# EAGLE design glass_udrive_pcb (EAGLE 7.7.0)
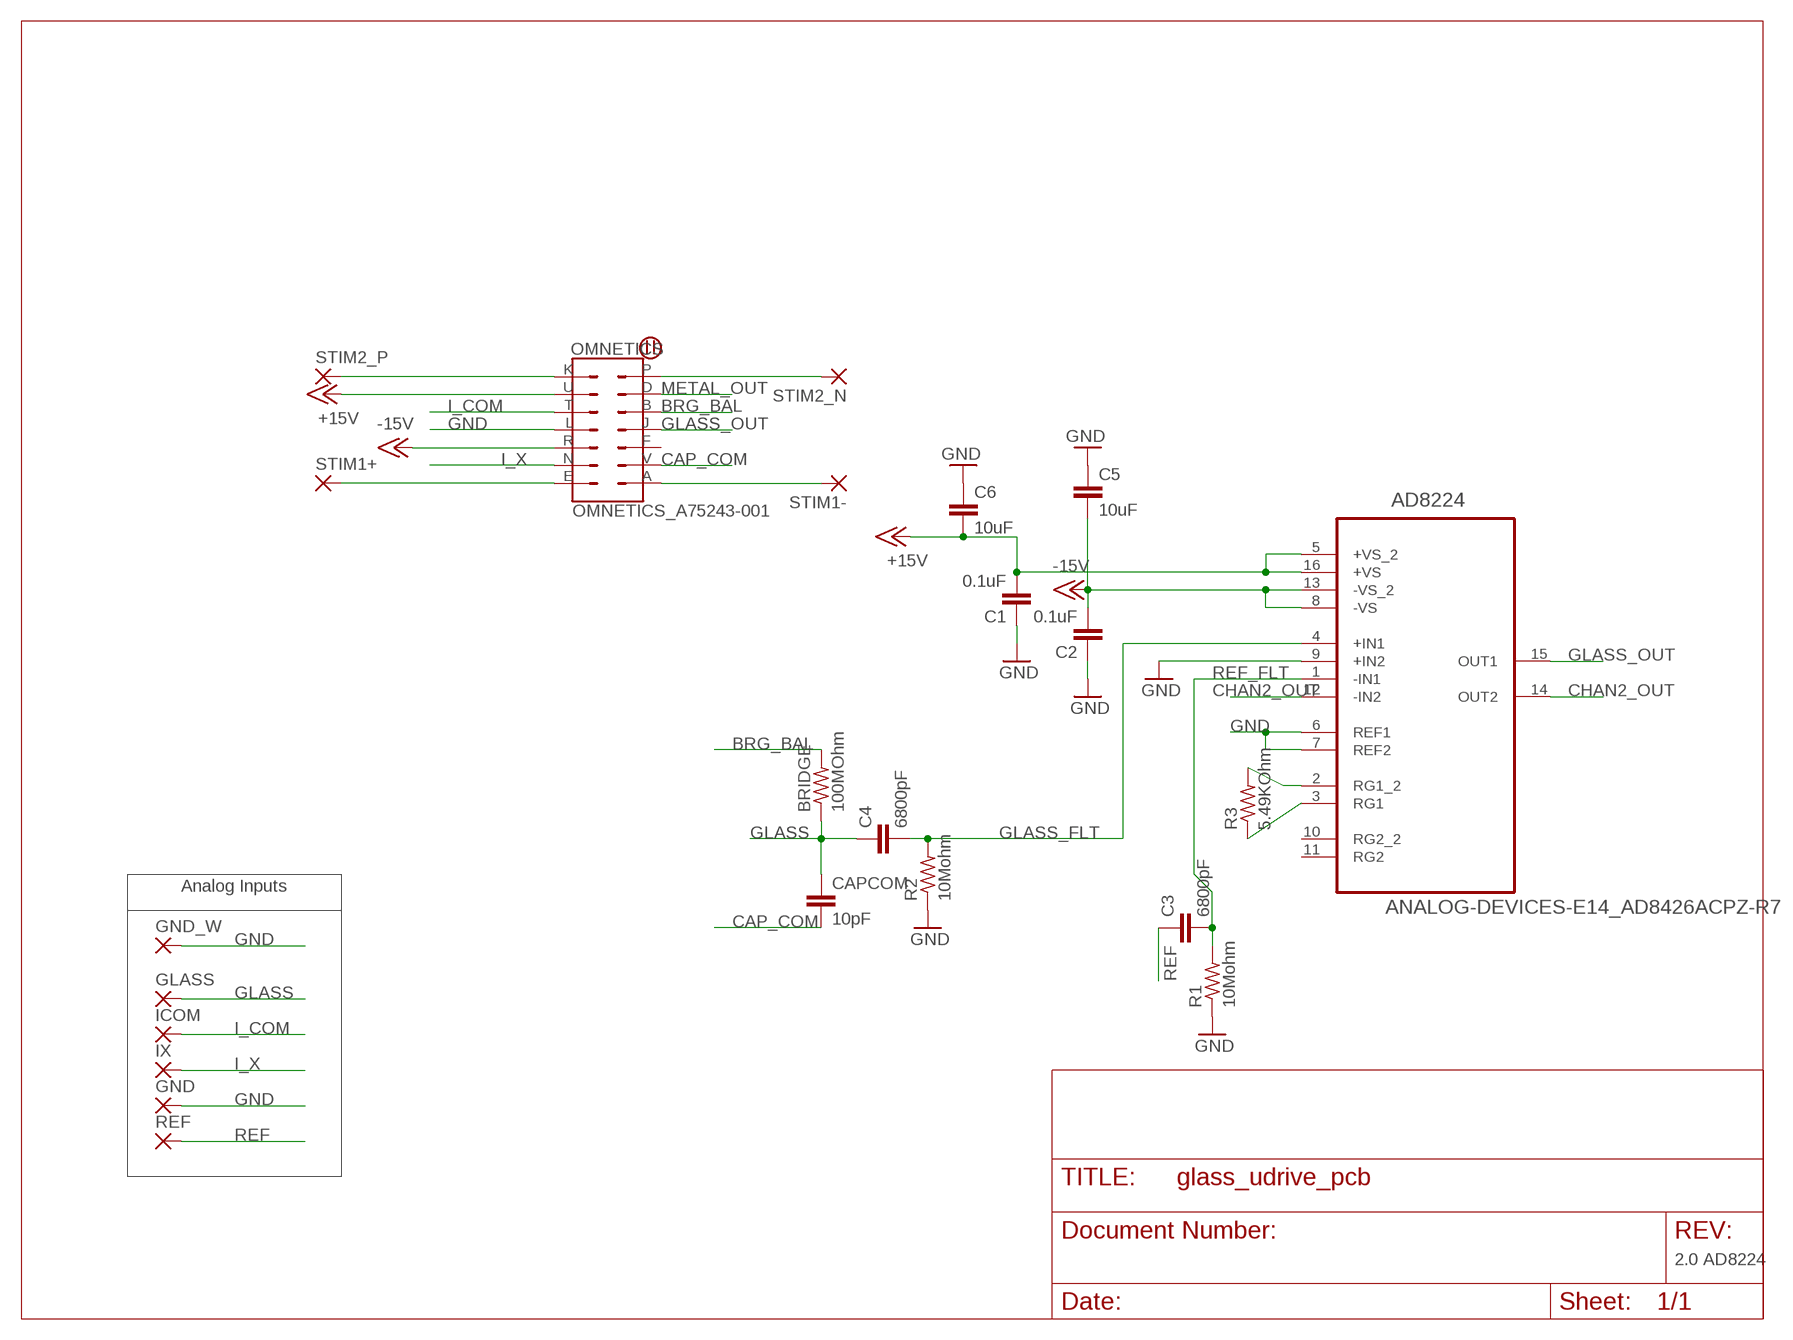
[diagram p0: schematic, sheet 1]

## Parts
AD8224  ANALOG-DEVICES-E14_AD8426ACPZ-R7  [ANALOG-DEVICES-E14_QFN65P400X400X100-16N]
BRIDGE  100MOhm  R_1206  [1206]
C1  0.1uF  C_0201  [0201]
C2  0.1uF  C_0201  [0201]
C3  6800pF  C_0201  [0201]
C4  6800pF  C_0201  [0201]
C5  10uF  C_0603  [0603]
C6  10uF  C_0603  [0603]
CAPCOM  10pF  C_0402  [0402]
GLASS  THROUGH-HOLE-30MIL/15MIL  [30MIL/15MIL]
GND  THROUGH-HOLE-30MIL/15MIL  [30MIL/15MIL]
GND_W  THROUGH-HOLE-30MIL/15MIL  [30MIL/15MIL]
ICOM  THROUGH-HOLE-30MIL/15MIL  [30MIL/15MIL]
IX  THROUGH-HOLE-30MIL/15MIL  [30MIL/15MIL]
OMNETICS  OMNETICS_A75243-001  [OMNETICS_A75243-001]
R1  10Mohm  R_0201  [0201]
R2  10Mohm  R_0201  [0201]
R3  5.49KOhm  R_0201  [0201]
REF  THROUGH-HOLE-30MIL/15MIL  [30MIL/15MIL]
STIM1+  THROUGH-HOLE-30MIL/15MIL  [30MIL/15MIL]
STIM1-  THROUGH-HOLE-30MIL/15MIL  [30MIL/15MIL]
STIM2_N  THROUGH-HOLE-30MIL/15MIL  [30MIL/15MIL]
STIM2_P  THROUGH-HOLE-30MIL/15MIL  [30MIL/15MIL]

## Nets
+15V: AD8224.5(+VS_2) AD8224.16(+VS) C1.2 C6.2 OMNETICS.U
-15V: AD8224.8(-VS) AD8224.13(-VS_2) C2.2 C5.2 OMNETICS.R
BRG_BAL: BRIDGE.2 OMNETICS.B
CAP_COM: CAPCOM.2 OMNETICS.V
CHAN2_OUT: AD8224.12(-IN2) AD8224.14(OUT2)
GLASS: BRIDGE.1 C4.1 CAPCOM.1 GLASS.P$1(P)
GLASS_FLT: AD8224.4(+IN1) C4.2 R2.2
GLASS_OUT: AD8224.15(OUT1) OMNETICS.J
GND: AD8224.6(REF1) AD8224.7(REF2) AD8224.9(+IN2) C1.1 C2.1 C5.1 C6.1 GND.P$1(P) GND_W.P$1(P) OMNETICS.L R1.1 R2.1
I_COM: ICOM.P$1(P) OMNETICS.T
I_X: IX.P$1(P) OMNETICS.N
METAL_OUT: OMNETICS.D
N$2: AD8224.2(RG1_2) R3.2
N$4: AD8224.3(RG1) R3.1
REF: C3.1 REF.P$1(P)
REF_FLT: AD8224.1(-IN1) C3.2 R1.2
STIM1_N: OMNETICS.A STIM1-.P$1(P)
STIM1_P: OMNETICS.E STIM1+.P$1(P)
STIM2_N: OMNETICS.P STIM2_N.P$1(P)
STIM2_P: OMNETICS.K STIM2_P.P$1(P)
Unconnected: AD8224.10(RG2_2) AD8224.11(RG2) OMNETICS.F

## Notes on the sheet
- Analog Inputs
- 2.0 AD8224

## Library data of the parts
AD8224 = GyroDrive:ANALOG-DEVICES-E14_AD8426ACPZ-R7: Wide Supply Range, Rail-to-Rail Output Instrumentation Amplifier; MPN: AD8426ACPZ-R7; OC_FARNELL: 1971714; OC_NEWARK: 58T4523; PACKAGE: LFCSP-16; SUPPLIER: Analog Devices
BRIDGE R1-R3 = GFL:R: Resistor
C1-C6 CAPCOM = GFL:C: Capacitor
GLASS GND GND_W ICOM IX REF STIM1+ STIM1- STIM2_N STIM2_P = GFL:THROUGH-HOLE-30MIL/15MIL: THROUGH-HOLE PAD
OMNETICS = GFL:OMNETICS_A75243-001

## Board
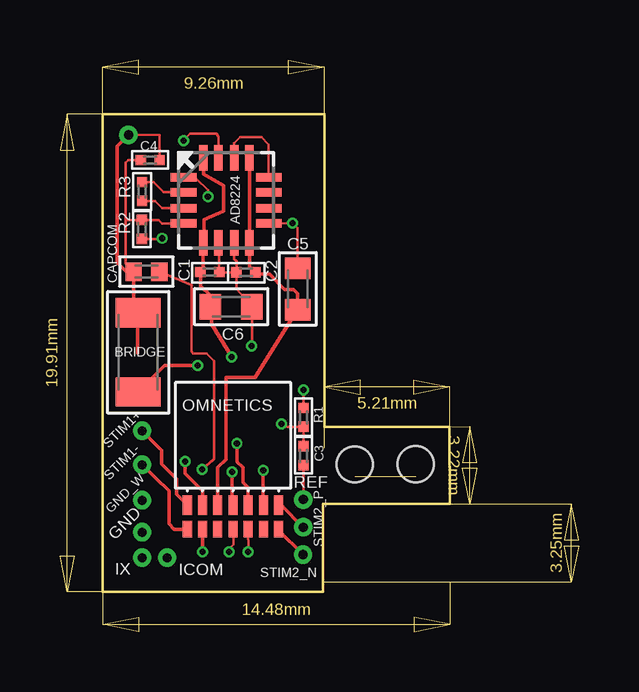
[diagram p1: board, top side]
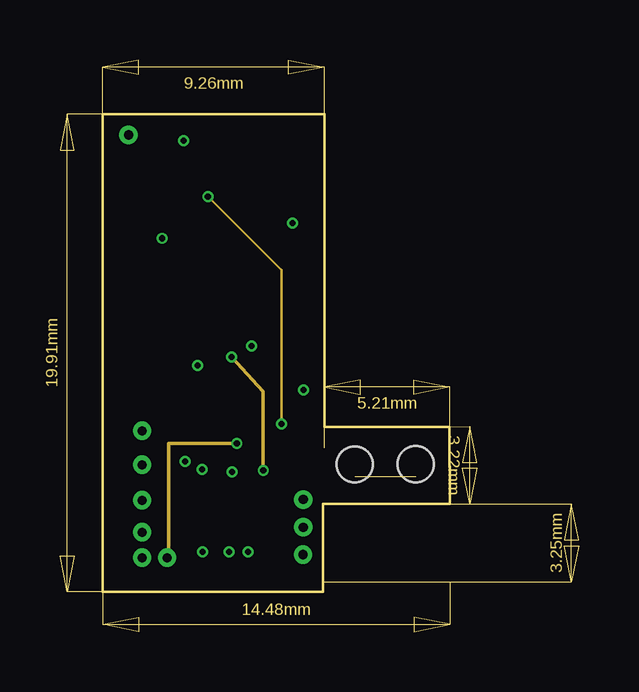
[diagram p2: board, inner layer Route2]
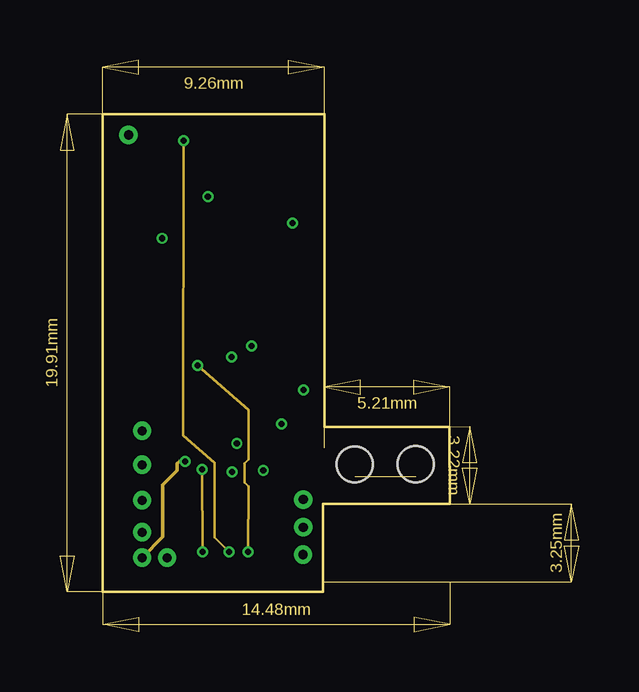
[diagram p3: board, inner layer Route15]
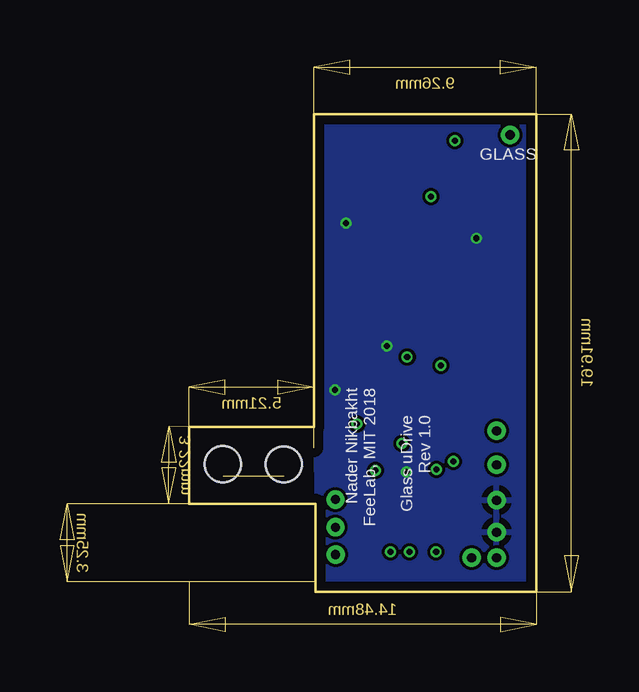
[diagram p4: board, bottom side, seen from below]

Size 14.48 x 19.91 mm. Coordinates in mm from the lower left corner, seen from the top.
Outline: 9.26,6.87 9.26,19.91 0,19.91 0,0 9.2,0 9.2,3.66 14.48,3.66 14.47,6.88 9.26,6.88
Copper layers (1*2*15*16): Top 0.035559375mm / dielectric 0.17018125mm / Route2 0.01778125mm / dielectric 47mil / Route15 0.01778125mm / dielectric 0.17018125mm / Bottom 0.035559375mm
Design rules "pcbway *": minimum track width 4mil, minimum drill 10mil, track to track 5mil, track to pad 5mil, pad to pad 5mil, via to via 5mil, smd to smd 5mil, copper to edge 15mil, drill to drill 6mil, minimum pad ring 4mil, minimum via ring 4mil, stop-mask expansion 2.5mil, vias tented up to drill 12mil, thermal gap 10mil
Holes 1.5 mm at 10.52,5.3 13.06,5.31

### Footprints (pad centres in the part's own frame; a part is rotated, then mirrored left to right if it is on the bottom)
ANALOG-DEVICES-E14_QFN65P400X400X100-16N = smd 1.067 x 0.356: 1 -1.778,0.965; 2 -1.778,0.33; 3 -1.778,-0.33; 4 -1.778,-0.965; 9 1.778,-0.965; 10 1.778,-0.33; 11 1.778,0.33; 12 1.778,0.965 | smd 0.356 x 1.067: 5 -0.965,-1.778; 6 -0.33,-1.778; 7 0.33,-1.778; 8 0.965,-1.778; 13 0.965,1.778; 14 0.33,1.778; 15 -0.33,1.778; 16 -0.965,1.778
1206 = smd 1.219 x 1.88: 1 -1.651,0; 2 1.651,0
0201 = smd 0.432 x 0.432: 1 -0.394,0; 2 0.394,0
0603 = smd 0.889 x 1.067: 1 -0.864,0; 2 0.864,0
0402 = smd 0.686 x 0.762: 1 -0.533,0; 2 0.533,0
30MIL/15MIL = drill 0.381 pad 0.762: P$1 0,0
OMNETICS_A75243-001 = smd 0.381 x 0.686: A -1.905,-0.47; B 0.635,-0.47; D 1.27,-0.47; F -0.635,-0.47; J 0,-0.47; P 1.905,-0.47; V -1.27,-0.47 | smd 0.381 x 0.813: E -1.905,0.533; K 1.905,0.533; L 0,0.533; N -1.27,0.533; R -0.635,0.533; T 0.635,0.533; U 1.27,0.533

### Placement (x,y rotation side)
AD8224  5.16,16.31 0 top
BRIDGE  1.49,9.98 270 top
C1  4.47,13.32 180 top
C2  5.98,13.31 0 top
C3  8.38,5.66 90 top
C4  1.99,17.99 180 top
C5  8.14,12.62 270 top
C6  5.37,11.88 180 top
CAPCOM  1.83,13.34 0 top
GLASS  1.08,19.04 0 top
GND  1.65,2.48 0 top
GND_W  1.65,3.81 0 top
ICOM  2.69,1.42 0 top
IX  1.65,1.42 0 top
OMNETICS  5.44,3.08 0 top
R1  8.38,7.26 270 top
R2  1.64,15.1 90 top
R3  1.65,16.68 90 top
REF  8.37,3.84 0 top
STIM1+  1.65,6.71 0 top
STIM1-  1.65,5.29 0 top
STIM2_N  8.36,1.55 0 top
STIM2_P  8.37,2.69 0 top

### Tracks (layer width: path | path; a pad name or v marks a point on that pad's centre or on a via)
+15V  (via drill 0.25)
  Top 0.127: 4.22,18.07 AD8224.16
  Top 0.152: 4.26,14.6 AD8224.5 | AD8224.5 4.2,13.5 C1.2 | OMNETICS.U v6.71,5.05 | C1.2 | 4.22,18.07 4.22,17.42 5.05,16.94 5.05,15.87 4.24,15.51 4.24,14.58 AD8224.5 | 4.52,11.97 C6.2 | C6.2 4.5,12.34 4.09,12.75 4.09,13.31 C1.2 | v5.38,9.79 5.38,9.81 4.55,11.15 4.55,11.94 C6.2
  Route2 0.152: v6.71,5.05 6.71,8.36 v5.38,9.79
-15V
  Top 0.152: OMNETICS.R 4.81,5.17 5.15,5.52 5.15,8.94 6.36,8.94 C5.2 8.14,12.43 7.98,12.6 7.6,12.6 6.96,13.23 6.46,13.23 C2.2 6.13,13.56 AD8224.8 AD8224.13
BRG_BAL  (via drill 0.25)
  Top 0.102: v6.07,1.66 6.09,1.69 OMNETICS.B
  Top 0.152: v3.97,9.42 2.59,9.42 BRIDGE.2
  Route15 0.102: v3.97,9.42 6.08,7.57 6.08,5.51 5.93,5.36 5.93,4.55 6.08,4.4 v6.07,1.66
CAP_COM  (via drill 0.25)
  Top 0.102: v4.15,5.1 v4.15,5.11 4.63,5.51 4.65,5.53 4.65,9.63 4.34,9.93 3.79,9.93 3.71,10.01 3.71,12.79 CAPCOM.2
  Top 0.152: v4.17,1.66 OMNETICS.V
  Route15 0.102: v4.15,5.1 v4.17,1.66
CHAN2_OUT
  Top 0.102: AD8224.14 5.49,18.69 5.74,18.94 6.63,18.94 6.93,18.64 AD8224.12
  Top 0.152: AD8224.12
GLASS
  Top 0.102: GLASS.P$1 2.38,19.04 C4.1
  Top 0.152: 1.47,9.96 1.47,11.63 BRIDGE.1 1.3,11.63 CAPCOM.1 0.98,13.34 0.61,13.72 0.61,18.57 GLASS.P$1
GLASS_FLT
  Top 0.102: C4.2 1.08,17.99 0.97,17.88 0.97,15.44 | 0.97,15.44 0.97,13.68 | 0.97,15.44 1.02,15.5 R2.2 2.33,15.5 2.49,15.34 AD8224.4
GLASS_OUT  (via drill 0.25)
  Top 0.102: AD8224.15 4.83,18.94 4.76,19.09 3.66,19.09 v3.39,18.8 3.36,18.61 | v5.28,1.66 5.28,1.79 5.46,1.97 5.46,2.59
  Top 0.152: 5.46,2.59 OMNETICS.J
  Route15 0.102: v3.39,18.8 3.36,6.51 4.68,5.37 4.67,4.42 4.67,2.27 v5.28,1.66
GND  (via drill 0.25)
  Top 0.102: AD8224.7 5.49,13.87 5.58,13.78 C2.1 | AD8224.6 4.87,14.5 C1.1 4.88,13.31 C2.1 | R1.1 v8.38,8.41 | AD8224.9 7.35,15.35 v7.93,15.37 8.14,15.16 C5.1 | 5.58,13.32 C2.1 | C6.1 v6.23,10.24 v6.22,10.24 | C6.1 6.23,12.08 | C2.1 | C2.1 5.59,12.63 C6.1 | R2.1 2.47,14.71 v2.49,14.73
  Top 0.152: OMNETICS.L 5.41,3.64 v5.41,5 | AD8224.7
  Bottom 0.102: v8.38,8.41 8.41,8.43 | v7.93,15.37 7.95,15.35 | v6.22,10.24 6.12,10.24 | v2.49,14.73 2.44,14.78
  Bottom 0.152: v5.41,5 v5.4,5.01 5.4,5.02 5.42,5.04 5.43,5.04
  pour Bottom: 0,19.91 9.25,19.9 9.19,0 0,0
I_COM  (via drill 0.25)
  Top 0.152: OMNETICS.T 6.07,4.35 5.86,4.56 5.86,5.18 5.61,5.41 v5.6,6.18
  Route2 0.152: v5.6,6.18 2.76,6.18 2.76,1.49 ICOM.P$1
I_X  (via drill 0.25)
  Top 0.152: OMNETICS.N 4.17,4.21 3.45,4.93 v3.45,5.44
  Route15 0.152: v3.45,5.44 3.21,5.44 3.12,5.35 3.12,5.06 2.51,4.45 2.51,2.28 IX.P$1
N$2
  Top 0.102: R3.2 2.12,17.08 2.54,16.66 3.37,16.66 AD8224.2
N$4
  Top 0.102: R3.1 2.2,16.29 2.49,16 3.37,16 AD8224.3
REF
  Top 0.102: REF.P$1 8.38,3.87 C3.1
REF_FLT  (via drill 0.25)
  Top 0.102: C3.2 R1.2 7.71,6.87 v7.47,6.99 | v4.39,16.48 4.39,16.73 3.91,17.21 3.45,17.21 AD8224.1
  Top 0.152: 3.45,17.21 AD8224.1
  Route2 0.102: v7.47,6.99 7.47,13.4 v4.39,16.48
STIM1_N
  Top 0.152: STIM1-.P$1 2.77,4.2 2.77,2.82 2.98,2.61 OMNETICS.A
STIM1_P
  Top 0.127: 3.52,3.62 OMNETICS.E
  Top 0.152: 3.52,3.62 3.1,4.05 3.1,4.7 2.46,5.33 2.46,5.88 STIM1+.P$1
STIM2_N
  Top 0.127: OMNETICS.P 7.35,2.56
  Top 0.152: 7.35,2.56 STIM2_N.P$1
STIM2_P
  Top 0.127: OMNETICS.K 7.45,3.61
  Top 0.152: 7.45,3.61 STIM2_P.P$1

### Text on the board
bPlace: Nader Nikbakht / FeeLab, MIT 2018 | Glass uDrive / Rev 1.0
_tsilk: STIM | GND
_bsilk: GND | ICOM